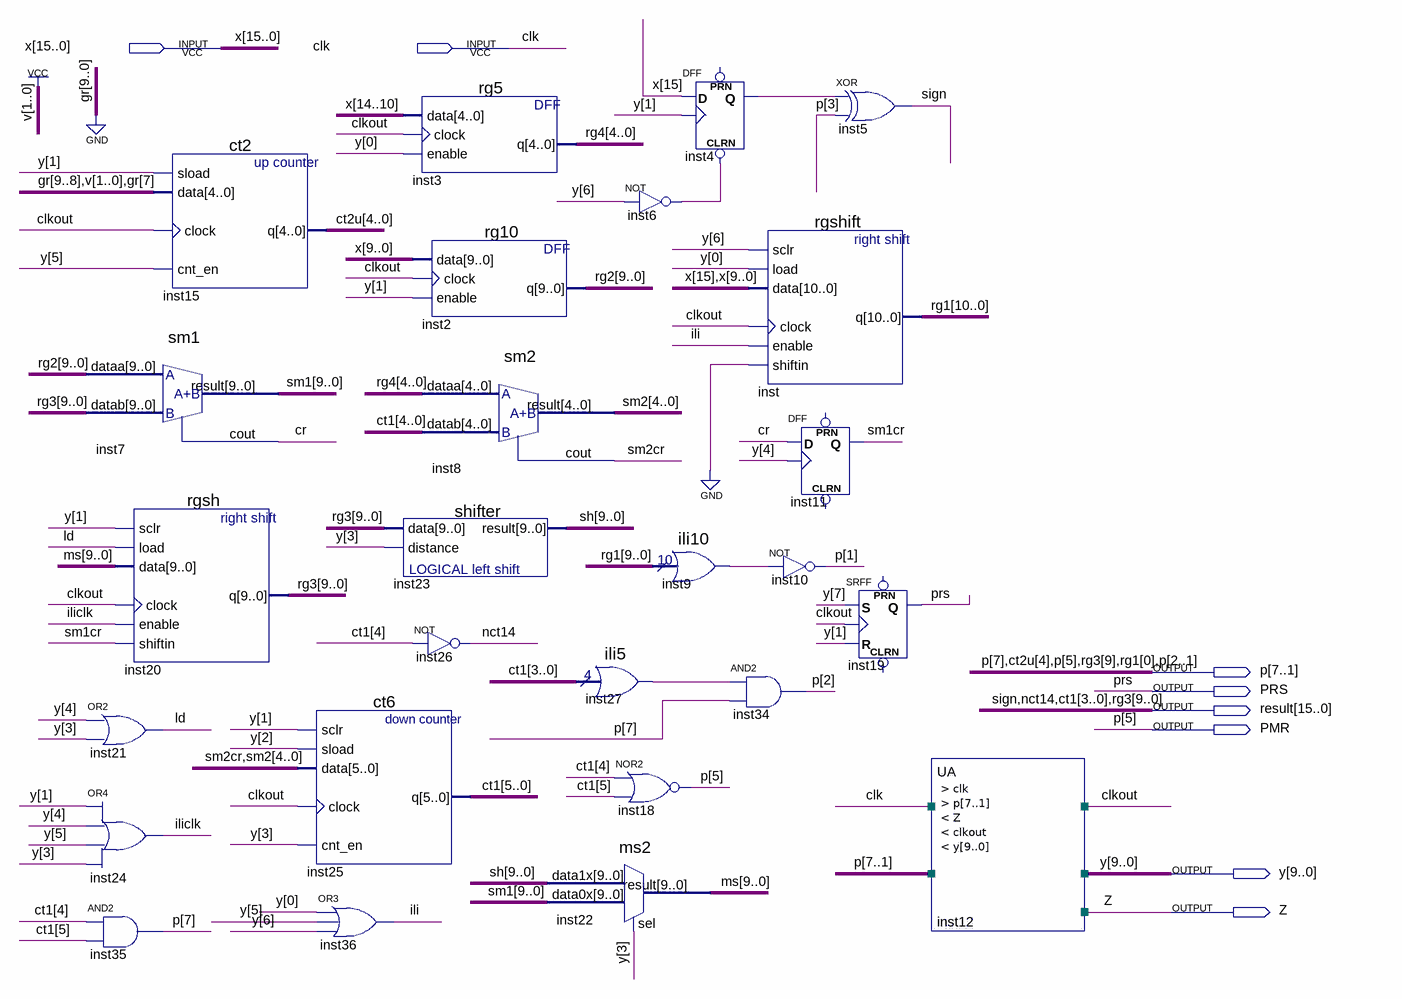
[diagram p0: schematic sheet]
// Quartus schematic Tavtologia.bdf as structural Verilog: 26 symbols, 8 pins
module Tavtologia (
  input  [15:0] x,
  input  clk,
  output [7:1] p,
  output PRS,
  output [15:0] result,
  output PMR,
  output [9:0] y,
  output Z
);

  wire clkout, cr, ili, iliclk, inst4_q, inst6_out, inst9_result, inst27_result, ld, sm1cr, sm2cr;
  wire [3:0] ct2u;
  wire [4:0] rg4, sm2;
  wire [5:4] ct1;
  wire [9:0] ms, rg2, sh, sm1;
  wire [10:1] rg1;

  sm1 inst7 (.dataa(rg2), .datab({p[4], result[8:0]}), .result(sm1), .cout(cr));
  rgsh inst20 (
    .sclr(y[1]), .load(ld), .data(ms), .clock(clkout), .enable(iliclk), .shiftin(sm1cr),
    .q({p[4], result[8:0]}));
  or inst21 (ld, y[4], y[3]);
  or inst24 (iliclk, y[1], y[4], y[5], y[3]);
  and inst35 (p[7], ct1[4], ct1[5]);
  ct2 inst15 (.sload(y[1]), .data(5'b00110), .clock(clkout), .cnt_en(y[5]), .q({p[6], ct2u}));
  ct6 inst25 (.sclr(y[1]), .sload(y[2]), .data({sm2cr, sm2}), .clock(clkout), .cnt_en(y[3]), .q({ct1, result[13:10]}));
  or inst36 (ili, y[0], y[5], y[6]);
  rg5 inst3 (.data(x[14:10]), .clock(clkout), .enable(y[0]), .q(rg4));
  rg10 inst2 (.data(x[9:0]), .clock(clkout), .enable(y[1]), .q(rg2));
  sm2 inst8 (.dataa(rg4), .datab({ct1[4], result[13:10]}), .result(sm2), .cout(sm2cr));
  shifter inst23 (.data({p[4], result[8:0]}), .distance(y[3]), .result(sh));
  not inst26 (result[14], ct1[4]);
  ili5 inst27 (.data(result[13:10]), .result(inst27_result));
  ms2 inst22 (.data1x(sh), .data0x(sm1), .sel(y[3]), .result(ms));
  DFF inst4 (.CLRN(inst6_out), .CLK(y[1]), .D(x[15]), .Q(inst4_q));  // open: PRN
  not inst6 (inst6_out, y[6]);
  ili10 inst9 (.data({rg1[9:1], p[3]}), .result(inst9_result));
  nor inst18 (p[5], ct1[4], ct1[5]);
  rgshift inst (
    .sclr(y[6]), .load(y[0]), .data({x[15], x[9:0]}), .clock(clkout), .enable(ili), .shiftin(1'b0),
    .q({rg1, p[3]}));
  and inst34 (p[2], inst27_result, p[7]);
  xor inst5 (result[15], inst4_q, p[3]);
  DFF inst11 (.CLK(y[4]), .D(cr), .Q(sm1cr));  // open: CLRN, PRN
  not inst10 (p[1], inst9_result);
  SRFF inst19 (.S(y[7]), .R(y[1]), .CLK(clkout), .Q(PRS));  // open: PRN, CLRN
  UA inst12 (.clk(clk), .p(p), .Z(Z), .clkout(clkout), .y(y));

  assign PMR = p[5];
  assign result[9] = p[4];

  // Other names for the same wires on the sheet: ct1[3:0] = result[13:10]; ct2u[4] = p[6]; nct14 = result[14];
  //   rg1[0] = p[3]; rg3[9:0] = {p[4], result[8:0]}; sign = result[15]
endmodule
